# EAGLE design stromsenke (EAGLE 5.11)
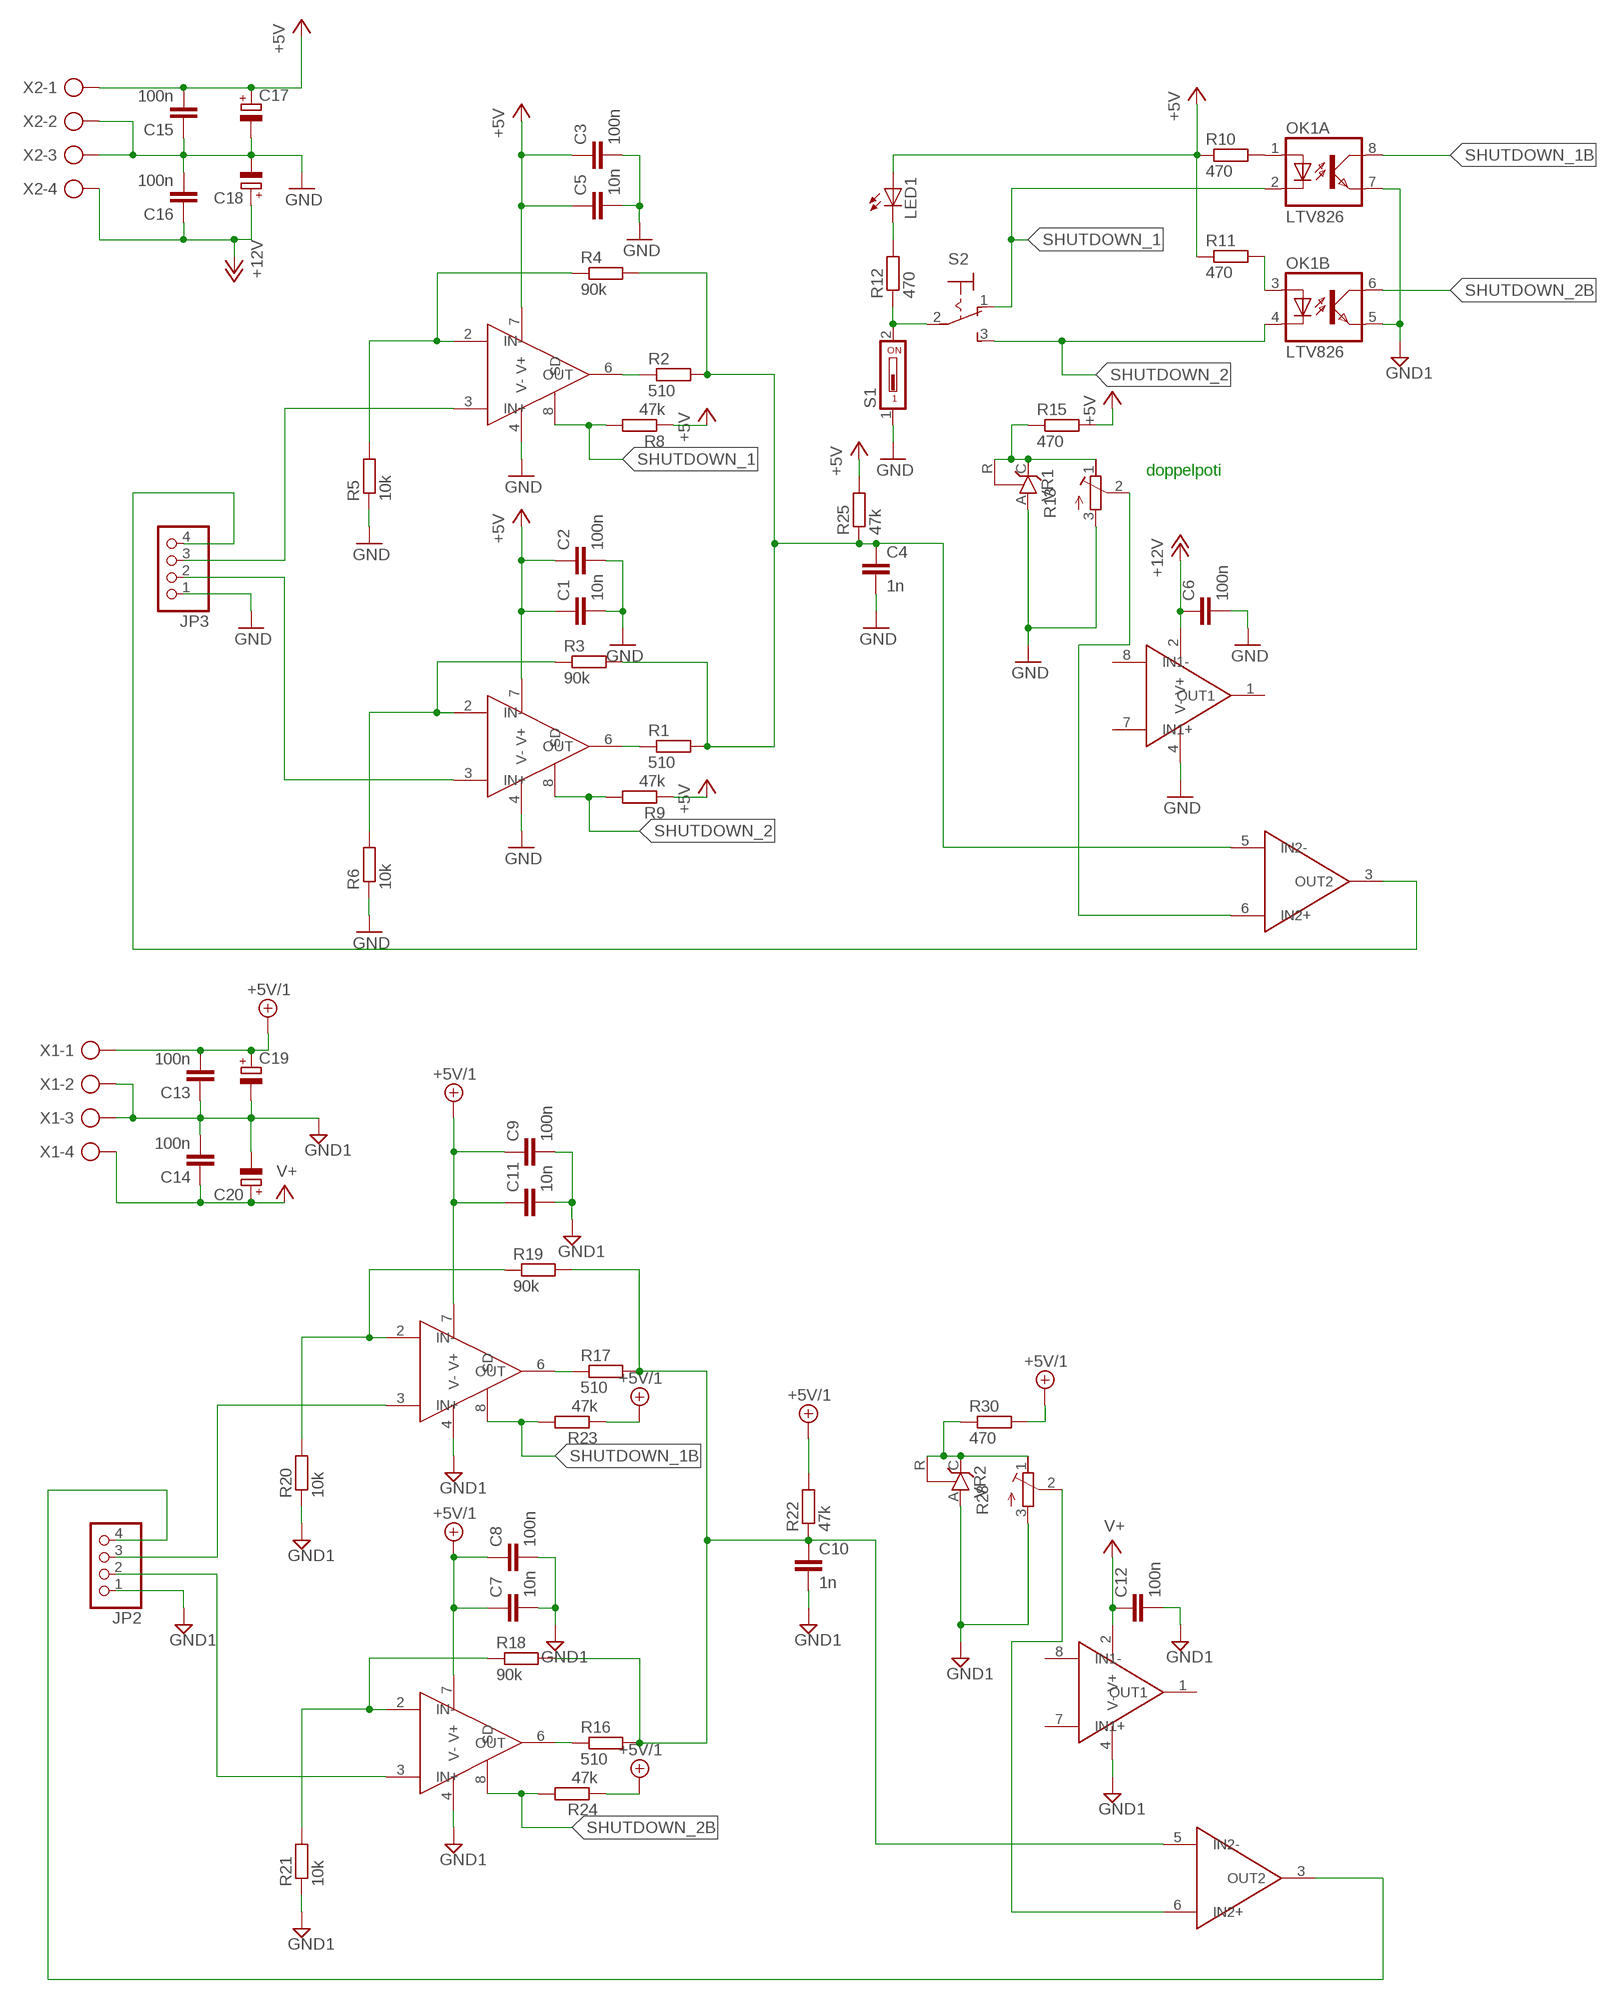
[diagram p0: schematic, sheet 1]

## Parts
C1  10n  C-EUC0805  [C0805]
C2  100n  C-EUC0805  [C0805]
C3  100n  C-EUC0805  [C0805]
C4  1n  C-EUC0805  [C0805]
C5  10n  C-EUC0805  [C0805]
C6  100n  C-EUC0805  [C0805]
C7  10n  C-EUC0805  [C0805]
C8  100n  C-EUC0805  [C0805]
C9  100n  C-EUC0805  [C0805]
C10  1n  C-EUC0805  [C0805]
C11  10n  C-EUC0805  [C0805]
C12  100n  C-EUC0805  [C0805]
C13  100n  C-EUC0805  [C0805]
C14  100n  C-EUC0805  [C0805]
C15  100n  C-EUC0805  [C0805]
C16  100n  C-EUC0805  [C0805]
C17  CPOL-EUE5-13  [E5-13]
C18  CPOL-EUE5-13  [E5-13]
C19  CPOL-EUE5-13  [E5-13]
C20  CPOL-EUE5-13  [E5-13]
JP2  PINHD-1X4  [1X04]
JP3  PINHD-1X4  [1X04]
LED1  LED5MM  [LED5MM]
MA1  LMH6647  [SO8]
MA2  LMH6647  [SO8]
MA3  LMH6647  [SO8]
MA4  LMH6647  [SO8]
OK1  LTV826  [DIL08]
R1  510  R-EU_0207/10  [0207/10]
R2  510  R-EU_0207/2V  [0207/2V]
R3  90k  R-EU_0207/10  [0207/10]
R4  90k  R-EU_0207/10  [0207/10]
R5  10k  R-EU_0207/10  [0207/10]
R6  10k  R-EU_0207/10  [0207/10]
R8  47k  R-EU_R0805  [R0805]
R9  47k  R-EU_R0805  [R0805]
R10  470  R-EU_R0805  [R0805]
R11  470  R-EU_R0805  [R0805]
R12  470  R-EU_R0805  [R0805]
R13  R-TRIMMT93XB  [RTRIMT93XB]
R15  470  R-EU_R0805  [R0805]
R16  510  R-EU_0207/10  [0207/10]
R17  510  R-EU_0207/10  [0207/10]
R18  90k  R-EU_0207/10  [0207/10]
R19  90k  R-EU_0207/10  [0207/10]
R20  10k  R-EU_0207/10  [0207/10]
R21  10k  R-EU_0207/10  [0207/10]
R22  47k  R-EU_R0805  [R0805]
R23  47k  R-EU_R0805  [R0805]
R24  47k  R-EU_R0805  [R0805]
R25  47k  R-EU_0207/10  [0207/10]
R28  R-TRIMMT93XB  [RTRIMT93XB]
R30  470  R-EU_R0805  [R0805]
S1  DS01  [DS-01]
S2  M9040P  [M9040P]
U$1  TCA0372  [DIL08]
U$2  TCA0372  [DIL08]
VR1  TL431CLP  [TO92-CLP]
VR2  TL431CLP  [TO92-CLP]
X1  AK300/4  [AK300/4]
X2  AK300/4  [AK300/4]

## Nets
+5V: C1.1 C2.1 C3.1 C5.1 C15.2 C17.+ LED1.A MA1.7(V+) MA2.7(V+) R8.1 R9.1 R10.1 R11.1 R15.2 R25.2 X2.1
+5V/1: C7.1 C8.1 C9.1 C11.1 C13.2 C19.+ MA3.7(V+) MA4.7(V+) R22.2 R23.1 R24.1 R30.2 X1.1
+12V: C6.1 C16.1 C18.+ U$1.2(V+) X2.4
GND: C1.2 C2.2 C3.2 C4.2 C5.2 C6.2 C15.1 C16.2 C17.- C18.- JP3.1 MA1.4(V-) MA2.4(V-) R5.1 R6.1 R13.3(E) S1.1 U$1.4(V-) VR1.A X2.2 X2.3
GND1: C7.2 C8.2 C9.2 C10.2 C11.2 C12.2 C13.1 C14.2 C19.- C20.- JP2.1 MA3.4(V-) MA4.4(V-) OK1.5(B:EMIT) OK1.7(A:EMIT) R20.1 R21.1 R28.3(E) U$2.4(V-) VR2.A X1.2 X1.3
N$1: R12.1 S1.2 S2.2(P)
N$2: MA1.6(OUT) R2.1
N$3: LED1.K(C) R12.2
N$4: MA1.2(IN-) R4.1 R5.2
N$5: JP3.4 U$1.3(OUT2)
N$6: MA2.6(OUT) R1.1
N$7: MA2.2(IN-) R3.1 R6.2
N$8: OK1.1(A:A) R10.2
N$9: OK1.3(B:A) R11.2
N$10: C4.1 R1.2 R2.2 R3.2 R4.2 R25.1 U$1.5(IN2-)
N$11: JP3.3 MA1.3(IN+)
N$13: JP3.2 MA2.3(IN+)
N$16: R13.2(S) U$1.6(IN2+)
N$18: R13.1(A) R15.1 VR1.C VR1.R
N$19: MA3.6(OUT) R17.1
N$20: MA3.2(IN-) R19.1 R20.2
N$22: MA4.6(OUT) R16.1
N$23: MA4.2(IN-) R18.1 R21.2
N$24: C10.1 R16.2 R17.2 R18.2 R19.2 R22.1 U$2.5(IN2-)
N$25: JP2.2 MA4.3(IN+)
N$26: JP2.3 MA3.3(IN+)
N$32: R28.2(S) U$2.6(IN2+)
N$33: R28.1(A) R30.1 VR2.C VR2.R
N$35: JP2.4 U$2.3(OUT2)
SHUTDOWN_1: MA1.8(SD) OK1.2(A:C) R8.2 S2.1(O)
SHUTDOWN_1B: MA3.8(SD) OK1.8(A:COL) R23.2
SHUTDOWN_2: MA2.8(SD) OK1.4(B:C) R9.2 S2.3(S)
SHUTDOWN_2B: MA4.8(SD) OK1.6(B:COL) R24.2
V+: C12.1 C14.1 C20.+ U$2.2(V+) X1.4
Unconnected: U$1.1(OUT1) U$1.7(IN1+) U$1.8(IN1-) U$2.1(OUT1) U$2.7(IN1+) U$2.8(IN1-)

## Notes on the sheet
- doppelpoti

## Library data of the parts
C1-C16 = rcl:C-EU: CAPACITOR, European symbol
C17-C20 = rcl:CPOL-EU: POLARIZED CAPACITOR, European symbol
JP2 JP3 = pinhead:PINHD-1X4: PIN HEADER
LED1 = led:LED: LED OSRAM: - CHIPLED LG R971, LG N971, LY N971, LG Q971, LY Q971, LO R971, LY R971 LH N974, LH R974 LS Q976, LO Q976, LY Q976 LO Q996 - Hyper CHIPLED LW Q18S LB Q993, LB Q99A, LB R99A - SideLED LS A670, LO A670, LY A670, LG A670, LP A670 LB A673, LV A673, LT A673, LW A673 LH A674 LY A675 LS A676, LA A676, LO A676, LY A676, LW A676 LS A679, LY A679, LG A679 - Hyper Micro SIDELED® LS Y876, LA Y876, LO Y876, LY Y876 LT Y87S - SmartLED LW L88C, LW L88S LB L89C, LB L89S, LG L890 LS L89K, LO L89K, LY L89K LS L896, LA L896, LO L896, LY L896 - TOPLED LS T670, LO T670, LY T670, LG T670, LP T670 LSG T670, LSP T670, LSY T670, LOP T670, LYG T670 LG T671, LOG T671, LSG T671 LB T673, LV T673, LT T673, LW T673 LH T674 LS T676, LA T676, LO T676, LY T676, LB T676, LH T676, LSB T676, LW T676 LB T67C, LV T67C, LT T67C, LS T67K, LO T67K, LY T67K, LW E67C LS E67B, LA E67B, LO E67B, LY E67B, LB E67C, LV E67C, LT E67C LW T67C LS T679, LY T679, LG T679 LS T770, LO T770, LY T770, LG T770, LP T770 LB T773, LV T773, LT T773, LW T773 LH T774 LS E675, LA E675, LY E675, LS T675 LS T776, LA T776, LO T776, LY T776, LB T776 LHGB T686 LT T68C, LB T68C - Hyper Mini TOPLED® LB M676 - Mini TOPLED Santana® LG M470 LS M47K, LO M47K, LY M47K Source: http://www.osram.convergy.de LUXEON: - LUMILED® LXK2-PW12-R00, LXK2-PW12-S00, LXK2-PW14-U00, LXK2-PW14-V00 LXK2-PM12-R00, LXK2-PM12-S00, LXK2-PM14-U00 LXK2-PE12-Q00, LXK2-PE12-R00, LXK2-PE12-S00, LXK2-PE14-T00, LXK2-PE14-U00 LXK2-PB12-K00, LXK2-PB12-L00, LXK2-PB12-M00, LXK2-PB14-N00, LXK2-PB14-P00, LXK2-PB14-Q00 LXK2-PR12-L00, LXK2-PR12-M00, LXK2-PR14-Q00, LXK2-PR14-R00 LXK2-PD12-Q00, LXK2-PD12-R00, LXK2-PD12-S00 LXK2-PH12-R00, LXK2-PH12-S00 LXK2-PL12-P00, LXK2-PL12-Q00, LXK2-PL12-R00 Source: www.luxeon.com KINGBRIGHT: KA-3528ASYC Source: www.kingbright.com
MA1-MA4 = lmh6647:LMH6647: LMH6645/46/47 2.7V, 650?A, 55MHz, Rail-to-Rail Input and Output Amplifiers with Shutdown Option
OK1 = optocoupler:LTV826: OPTO COUPLER Source: LITEON, LTV816.pdf; OC_FARNELL: unknown; OC_NEWARK: unknown
R1-R6 R8-R12 R15-R25 R30 = rcl:R-EU_: RESISTOR, European symbol
R13 R28 = resistor:R-TRIMM: Trimm resistor
S1 = switch-dil:DS01: DIL/CODE SWITCH; OC_FARNELL: unknown; OC_NEWARK: unknown
S2 = switch:M9040P: TOGGLE SWITCH Marquardt
U$1 U$2 = tca0372:TCA0372
VR1 VR2 = v-reg:TL431CLP: VOLTAGE REGULATOR
X1 X2 = con-ptr500:AK300/4: CONNECTOR; OC_FARNELL: unknown; OC_NEWARK: unknown

## Board
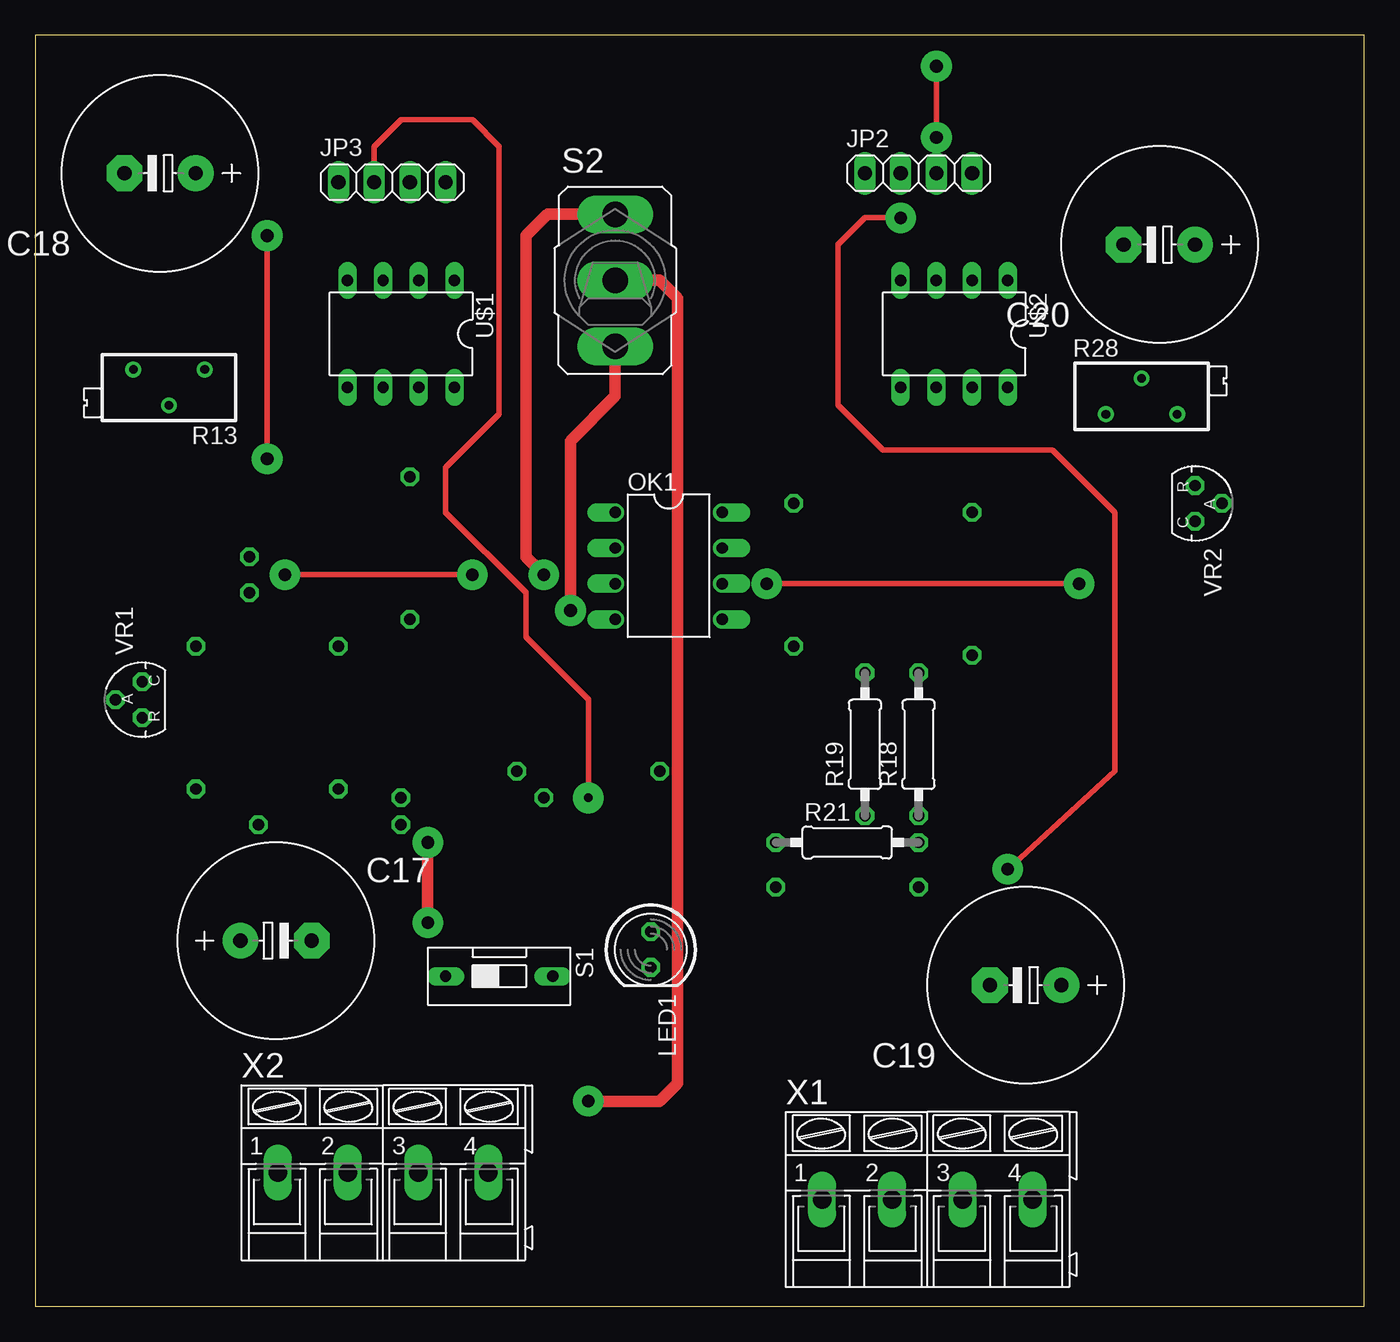
[diagram p1: board, top side]
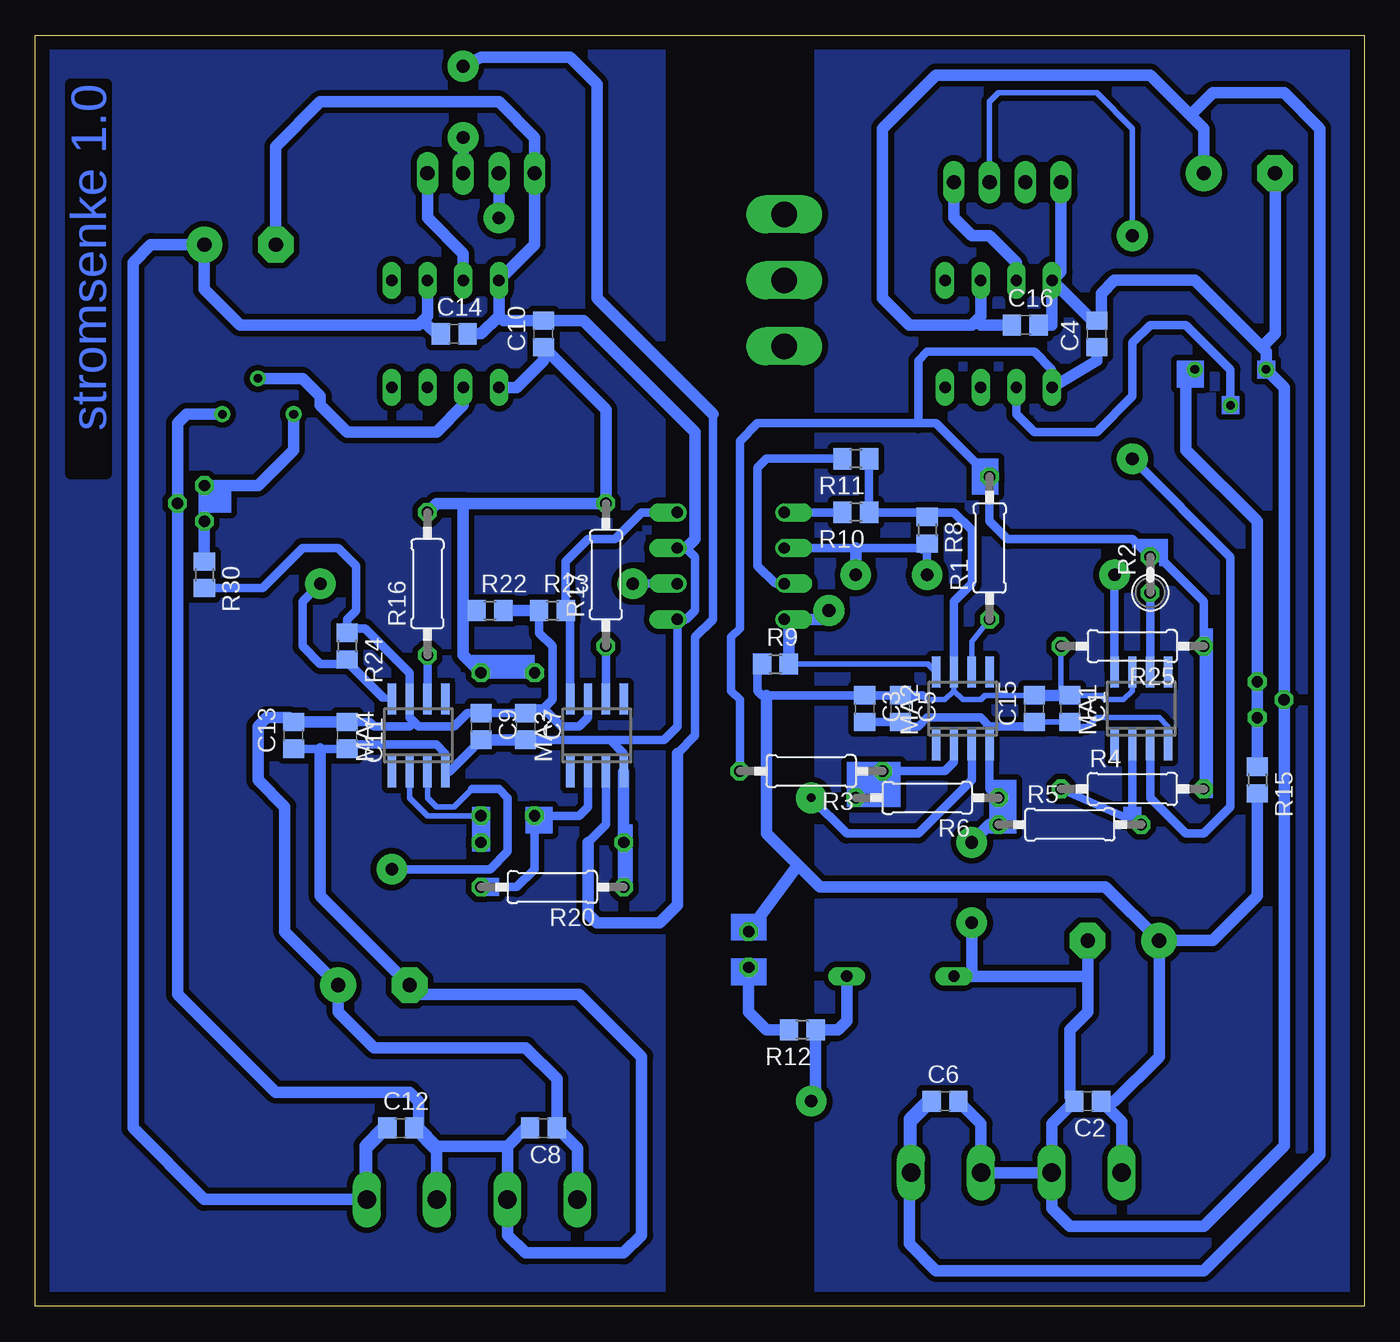
[diagram p2: board, bottom side, seen from below]

Size 94.59 x 90.47 mm. Coordinates in mm from the lower left corner, seen from the top.
Outline: 0,0 94.59,0 94.59,90.47 0,90.47 0,0
Copper layers (1*16): Top 0.035mm / dielectric 1.5mm / Bottom 0.035mm
Design rules "default": minimum track width 10mil, minimum drill 24mil, track to track 8mil, track to pad 8mil, pad to pad 8mil, via to via 8mil, smd to smd 8mil, copper to edge 40mil, drill to drill 8mil, minimum pad ring 10mil, minimum via ring 8mil, stop-mask expansion 4mil, vias tented up to drill 0mil, thermal gap 10mil
bRestrict: area 40,0.6 to 48.9,90.2

### Footprints (pad centres in the part's own frame; a part is rotated, then mirrored left to right if it is on the bottom)
C0805 = smd 1.3 x 1.5: 1 -0.95,0; 2 0.95,0
E5-13 = drill 1.016 pad 2.54 round: + -2.54,0 | drill 1.016 pad 2.54 octagon: - 2.54,0
1X04 = drill 1.016 long: 1 -3.81,0; 2 -1.27,0; 3 1.27,0; 4 3.81,0
LED5MM = drill 0.813 octagon: A -1.27,0; K 1.27,0
SO8 = smd 0.6 x 2.2: 1 -1.905,-2.6; 2 -0.635,-2.6; 3 0.635,-2.6; 4 1.905,-2.6; 5 1.905,2.6; 6 0.635,2.6; 7 -0.635,2.6; 8 -1.905,2.6
DIL08 = drill 0.813 offset: 1 -3.81,-3.81; 2 -1.27,-3.81; 3 1.27,-3.81; 4 3.81,-3.81; 5 3.81,3.81; 6 1.27,3.81; 7 -1.27,3.81; 8 -3.81,3.81
0207/10 = drill 0.813 octagon: 1 -5.08,0; 2 5.08,0
0207/2V = drill 0.813 octagon: 1 -1.27,0; 2 1.27,0
R0805 = smd 1.3 x 1.5: 1 -0.95,0; 2 0.95,0
RTRIMT93XB = drill 0.61 round: 1 1.27,-2.54; 2 -1.27,0; 3 1.27,2.54
DS-01 = drill 0.813 long: 1 0,-3.81; 2 0,3.81
M9040P = drill 1.803 long: 1 0,4.699; 2 0,0; 3 0,-4.699
DIL08' = drill 0.813 long: 1 -3.81,-3.81; 2 -1.27,-3.81; 3 1.27,-3.81; 4 3.81,-3.81; 5 3.81,3.81; 6 1.27,3.81; 7 -1.27,3.81; 8 -3.81,3.81
TO92-CLP = drill 0.813 octagon: A 0,1.905; C 1.27,0; R -1.27,0
AK300/4 = drill 1.321 long: 1 -7.493,0; 2 -2.515,0; 3 2.515,0; 4 7.493,0

### Placement (x,y rotation side)
C1  20.95,42.55 270 bottom
C2  19.68,14.61 180 bottom
C3  35.56,42.55 270 bottom
C4  19.05,69.22 90 bottom
C5  33.02,42.55 270 bottom
C6  29.84,14.61 0 bottom
C7  59.69,41.27 270 bottom
C8  58.42,12.7 180 bottom
C9  62.87,41.27 270 bottom
C10  58.42,69.22 90 bottom
C11  72.39,40.64 270 bottom
C12  68.58,12.7 0 bottom
C13  76.2,40.64 90 bottom
C14  64.77,69.22 0 bottom
C15  23.5,42.55 90 bottom
C16  24.13,69.85 0 bottom
C17  17.14,26.04 0 top
C18  8.89,80.64 180 top
C19  70.48,22.86 180 top
C20  80.01,75.56 180 top
JP2  62.87,80.64 0 top
JP3  25.4,80.01 0 top
LED1  43.81,25.4 270 top
MA1  15.88,42.55 0 bottom
MA2  28.57,42.55 0 bottom
MA3  54.61,40.64 0 bottom
MA4  67.31,40.64 0 bottom
OK1  45.09,52.7 270 top
R1  26.67,53.98 90 bottom
R2  15.24,52.07 90 bottom
R3  39.37,38.1 180 bottom
R4  16.51,36.83 0 bottom
R5  20.95,34.29 0 bottom
R6  31.11,36.2 180 bottom
R8  31.11,55.24 270 bottom
R9  41.91,45.72 0 bottom
R10  36.2,56.52 180 bottom
R11  36.2,60.33 180 bottom
R12  40.01,19.68 180 bottom
R13  9.53,65.41 90 top
R15  7.62,37.47 270 bottom
R16  66.67,51.44 90 bottom
R17  53.98,52.07 90 bottom
R18  62.87,40.01 90 top
R19  59.05,40.01 90 top
R20  57.78,29.84 180 bottom
R21  57.78,33.02 0 top
R22  62.23,49.53 0 bottom
R23  57.78,49.53 0 bottom
R24  72.39,46.99 270 bottom
R25  16.51,46.99 180 bottom
R28  78.74,64.77 270 top
R30  82.55,52.07 270 bottom
S1  33.02,23.5 270 top
S2  41.27,73.03 0 top
U$1  TCA0372  [DIL08']  26.04,69.22 180 top
U$2  TCA0372  [DIL08']  65.41,69.22 180 top
VR1  7.62,43.18 90 top
VR2  82.55,57.15 270 top
X1  63.5,7.62 0 top
X2  24.77,9.53 0 top

### Tracks (layer width: path | path; a pad name or v marks a point on that pad's centre or on a via)
+5V
  Bottom 0.406: 31.43,56.52 R8.1 30.8,56.52 | C1.1 18.73,43.49 18.41,43.18 17.14,43.18 16.51,43.81 MA1.7 | 31.43,43.49 31.11,43.18 29.84,43.18 29.21,43.81 | 29.21,43.81 MA2.7 | C15.2 26.99,43.49 27.3,43.18 28.57,43.18 29.21,43.81 | 43.18,45.4 R9.1 | 21.59,43.49 R25.2
  Bottom 0.61: R11.1 R10.1 31.43,56.52 | 31.43,43.49 C5.1 C3.1 42.55,43.49 42.86,43.49 43.18,43.81 43.18,45.4 | MA2.7 29.21,50.16 27.94,51.44 27.94,55.24 29.21,56.52 30.8,56.52
  Bottom 0.813: C15.2 21.59,43.49 C1.1 | X2.1 17.27,13.14 C2.1 17.78,14.61 14.61,17.78 C17.+ | R15.2 7.62,29.21 10.79,26.04 C17.+ | C17.+ 18.41,29.84 38.73,29.84 40.32,31.43 | 40.32,31.43 42.55,33.66 42.55,43.49 | 40.32,31.43 LED1.A
+5V/1
  Bottom 0.406: C7.1 59.37,42.55 | 72.07,48.26 R24.1
  Bottom 0.61: MA3.7 55.24,41.91 55.88,41.27 57.15,41.27 58.42,42.55 | 59.37,42.55 58.42,42.55 | C7.1 C9.1 63.82,42.23 64.77,41.27 67.31,41.27 67.63,41.59 | 67.63,41.59 67.94,41.91 MA4.7 67.94,45.09 71.12,48.26 72.07,48.26 | C11.1 70.8,41.59 70.48,41.27 67.94,41.27 67.63,41.59 | R30.2 78.42,51.12 75.56,53.98 73.03,53.98 71.75,52.7 71.75,49.53 72.39,48.9 R24.1 | R23.1 58.73,47.94 57.78,46.99 57.78,43.18 58.42,42.55
  Bottom 0.813: X1.1 56.01,11.24 C8.1 57.47,16.2 59.69,18.41 70.48,18.41 73.03,20.95 C19.+ 76.83,26.67 76.83,35.56 78.74,37.47 78.74,41.27 78.11,41.91 76.52,41.91 C13.2 C11.1 | R23.1 R22.2
+12V
  Bottom 0.813: X2.4 32.26,13.14 C6.1 31.11,14.61 32.38,13.34 32.38,4.45 30.48,2.54 11.43,2.54 3.17,10.79 3.17,83.82 5.71,86.36 10.79,86.36 12.38,84.77 | 27.62,70.17 27.94,69.85 32.38,69.85 34.29,71.75 34.29,83.82 30.48,87.63 15.24,87.63 12.38,84.77 | 27.62,70.17 27.3,70.48 U$1.2 | C16.1 27.3,69.85 27.62,70.17 | C18.+ 11.43,83.82 12.38,84.77
GND  (via drill 0.9 pad 2.18)
  Top 0.813: v27.94,27.3 v27.94,33.02
  Bottom 0.406: MA1.4 13.97,41.27 14.61,41.91 19.05,41.91 19.68,41.27 20.64,41.27 C1.2 C15.1 23.82,41.27 | 32.7,41.27 C5.2 | MA2.4 26.67,40.01
  Bottom 0.61: 26.67,41.27 MA2.4 26.67,36.83 R6.1 R5.1 26.67,34.29 | 26.67,41.27 27.3,41.91 31.11,41.91 31.75,41.27 32.7,41.27 | C5.2 C3.2 | 26.67,41.27 23.82,41.27
  Bottom 0.813: X2.2 X2.3 27.28,12.99 C6.2 | X2.2 22.25,12.99 C2.2 20.95,14.93 20.95,19.68 19.68,20.95 19.68,23.5 | 19.68,23.5 C17.- | U$1.4 19.36,70.17 C4.2 18.73,70.48 18.73,72.08 17.78,73.03 12.06,73.03 7.3,68.26 | JP3.1 21.59,73.66 U$1.4 | X2.2 22.23,9.5 22.23,6.99 20.95,5.71 11.43,5.71 5.71,11.43 VR1.A 5.71,65.41 R13.3 6.99,67.94 7.3,68.26 | C16.2 22.23,69.85 U$1.4 | C18.- 6.35,69.22 7.3,68.26 | 19.68,23.5 27.94,23.5 | 27.94,23.5 S1.1 | v27.94,33.02 26.67,34.29 | 27.94,23.5 v27.94,27.3
GND1
  Bottom 0.406: MA4.4 65.15,38.04 | C11.2 72.08,40.01 | 48.26,53.98 OK1.7
  Bottom 0.61: C7.2 53.66,40.33 | 53.66,40.33 52.7,39.37 MA3.4 | 65.15,38.04 C9.2 | MA4.4 65.41,39.37 66.04,40.01 72.08,40.01 | 48.26,53.98 47.62,53.34 47.62,49.53 48.26,48.9 OK1.5 48.9,41.27 49.84,40.33 53.66,40.33 | C11.2 74.3,39.69 C13.1
  Bottom 0.813: 60.98,11.4 X1.2 60.96,7.59 60.96,5.08 59.69,3.81 52.7,3.81 51.44,5.08 51.44,17.78 55.88,22.23 67.31,22.23 C19.- 74.3,29.21 74.3,39.69 | 60.98,11.4 59.69,12.7 C8.2 | X1.3 66.02,11.09 C12.2 | MA3.4 R21.1 R20.1 | C9.2 C7.2 | R28.3 83.82,63.5 84.45,62.87 VR2.A 84.45,22.23 77.47,15.24 67.94,15.24 67.31,14.61 67.31,13.02 C12.2 | C14.2 62.87,69.22 61.59,70.48 | 61.59,70.48 U$2.4 59.05,75.56 JP2.1 59.05,83.19 61.59,85.72 74.3,85.72 77.47,82.55 C20.- | 61.59,70.48 61.27,70.17 C10.2 55.56,70.17 47.62,62.23 47.62,54.61 48.26,53.98 | C12.2 67.31,12.7 66.02,11.4 60.98,11.4
N$1  (via drill 0.9 pad 2.18)
  Top 0.813: v39.37,14.61 44.45,14.61 45.72,15.88 45.72,71.75 44.45,73.03 S2.2
  Bottom 0.813: S1.2 36.83,20.32 37.47,19.68 R12.1 39.05,14.92 v39.37,14.61
N$2
  Bottom 0.61: MA1.6 R2.1
N$3
  Bottom 0.813: R12.2 42.55,19.68 43.81,20.95 LED1.K
N$4
  Bottom 0.61: R4.1 R5.2 16.51,34.92 MA1.2
N$5
  Bottom 0.813: U$1.3 24.77,74.3 26.67,76.2 27.94,76.2 29.21,77.47 JP3.4
N$6
  Bottom 0.406: MA2.6 27.94,47.31 R1.1
N$7
  Bottom 0.61: MA2.2 29.21,38.73 29.84,38.1 R3.1 R6.2
N$8
  Bottom 0.61: R10.2 OK1.1
N$9
  Bottom 0.61: OK1.3 41.91,51.44 43.18,52.7 43.18,59.69 42.55,60.33 R11.2
N$10
  Bottom 0.61: R3.2 44.45,43.18 45.09,43.81 45.09,47.62 44.45,48.26 44.45,61.59 43.18,62.87 31.75,62.87 | 31.75,62.87 30.48,62.87 R1.2 26.67,55.88 25.4,54.61 16.51,54.61 R2.2 14.61,53.34 11.43,50.16 R25.1 R4.2 | U$1.5 22.23,66.67 23.5,67.94 31.11,67.94 31.75,67.31 31.75,62.87
  Bottom 0.813: C4.1 19.05,67.31 U$1.5
N$11  (via drill 0.9 pad 2.18)
  Top 0.406: v16.51,60.33 v16.51,76.2
  Bottom 0.406: JP3.3 26.67,85.72 26.04,86.36 19.05,86.36 16.51,83.82 v16.51,76.2
  Bottom 0.61: v16.51,60.33 9.53,53.34 9.53,35.56 11.43,33.66 12.7,33.66 15.24,36.2 MA1.3
N$12
  pour Bottom (isolate 0.406): 0,0 0,90.81 94.61,90.81 94.61,0
N$13  (via drill 0.6 pad 2.18)
  Top 0.406: v39.37,36.2 39.37,43.18 34.92,47.62 34.92,50.8 29.21,56.52 29.21,59.69 33.02,63.5 33.02,82.55 31.11,84.45 26.04,84.45 24.13,82.55 JP3.2
  Bottom 0.61: MA2.3 27.94,37.47 31.75,33.66 36.83,33.66 v39.37,36.2
N$16
  Bottom 0.61: U$1.6 24.77,63.5 23.5,62.23 19.05,62.23 16.51,64.77 16.51,68.58 15.24,69.85 12.7,69.85 9.53,66.67 R13.2
N$18
  Bottom 0.813: R15.1 VR1.R VR1.C 7.62,55.88 12.7,60.96 12.7,66.04 R13.1
N$19
  Bottom 0.61: MA3.6 R17.1
N$20
  Bottom 0.61: MA3.2 55.24,35.56 55.88,34.92 R19.1 59.05,31.11 60.33,29.84 R20.2
N$22
  Bottom 0.61: MA4.6 R16.1
N$23
  Bottom 0.406: MA4.2 67.94,36.2 66.67,34.92 R18.1 R21.2
N$24
  Bottom 0.406: 64.14,49.53 R22.1
  Bottom 0.813: R19.2 R18.2 64.14,46.35 64.14,49.53 64.14,57.15 | 64.14,57.15 R17.2 53.98,63.82 C10.1 58.42,67.31 60.33,65.41 U$2.5 | 64.14,57.15 66.04,57.15 R16.2
N$25  (via drill 0.9 pad 2.18)
  Top 0.406: v61.59,77.47 59.05,77.47 57.15,75.56 57.15,64.14 60.33,60.96 72.39,60.96 76.83,56.52 76.83,38.1 v69.22,31.11
  Bottom 0.406: MA4.3 66.67,36.2 66.04,35.56 64.77,35.56 63.5,36.83
  Bottom 0.61: 63.5,36.83 61.59,36.83 60.96,36.2 60.96,32.38 62.23,31.11 v69.22,31.11
  Bottom 0.813: v61.59,77.47 JP2.2
N$26  (via drill 0.9 pad 2.18)
  Top 0.406: v64.14,88.27 v64.14,83.19
  Bottom 0.61: MA3.3 53.98,34.29 55.24,33.02 | 48.9,39.37 47.62,40.64 47.62,47.62 46.35,48.9 46.35,63.5
  Bottom 0.813: 55.24,33.02 55.24,27.94 54.61,27.3 50.16,27.3 48.9,28.57 48.9,39.37 | 46.35,63.5 54.61,71.75 54.61,87 56.52,88.9 62.87,88.9 v64.14,88.27 | v64.14,83.19 JP2.3
N$32
  Bottom 0.813: U$2.6 64.14,64.14 66.04,62.23 72.39,62.23 74.3,64.14 74.3,64.77 75.56,66.04 R28.2
N$33
  Bottom 0.813: R30.1 VR2.C VR2.R 78.74,58.42 76.2,60.96 R28.1
N$35
  Bottom 0.813: U$2.3 64.14,74.93 66.67,77.47 JP2.4
SHUTDOWN_1  (via drill 0.9 pad 2.18)
  Top 0.406: v17.78,52.07 v31.11,52.07
  Top 0.813: S2.1 36.45,77.72 34.92,76.2 34.92,53.34 v36.2,52.07
  Bottom 0.61: 31.43,53.98 36.2,53.98 OK1.2 | v31.11,52.07 R8.2 | MA1.8 v17.78,52.07
  Bottom 0.813: R8.2 31.43,53.98 | 36.2,53.98 v36.2,52.07
SHUTDOWN_1B
  Bottom 0.406: 56.52,49.21 R23.2
  Bottom 0.61: OK1.8 51.44,56.52 53.34,54.61 55.24,54.61 56.84,53.02 R23.2 | MA3.8 56.52,49.21
SHUTDOWN_2  (via drill 0.9 pad 2.18)
  Top 0.813: v38.1,49.53 38.1,61.59 41.27,64.77 S2.3
  Bottom 0.406: R9.2 31.05,45.72 MA2.8
  Bottom 0.813: R9.2 40.95,48.58 OK1.4 38.73,48.9 v38.1,49.53
SHUTDOWN_2B  (via drill 0.9 pad 2.18)
  Top 0.406: v52.07,51.44 v74.3,51.44
  Bottom 0.406: R24.2 69.59,43.24 MA4.8 69.91,43.24 72.39,45.72
  Bottom 0.61: 72.39,45.72 74.3,45.72 75.56,46.99 75.56,50.16 v74.3,51.44 | OK1.6 v52.07,51.44
V+
  Bottom 0.406: 66.04,69.22 C14.1 | U$2.2 66.67,69.85
  Bottom 0.813: X1.4 70.99,11.24 C12.1 69.85,12.7 71.12,11.43 71.12,7.62 82.55,7.62 87.63,12.7 87.63,74.3 86.36,75.56 C20.+ 82.55,72.39 80.01,69.85 67.31,69.85 66.67,70.48 U$2.2 | 66.67,69.85 66.04,69.22
(copper drawn outside any net)
  shapes: Bottom area x21

### Text on the board
Bottom: stromsenke 1.0